# Altium project MCP4725.PrjPcb
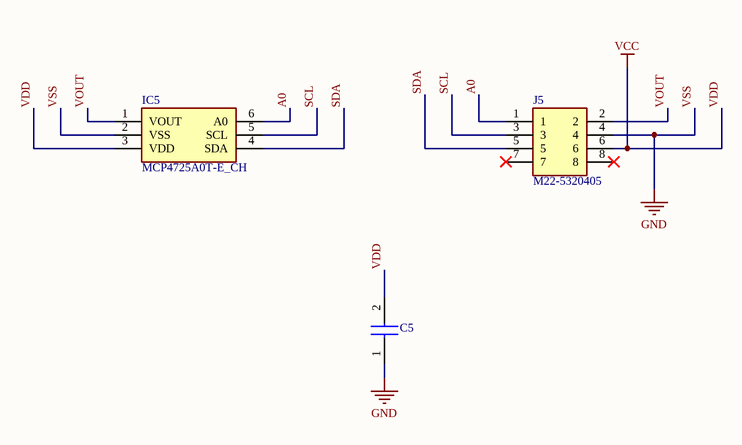
[diagram p0: MCP4725.SchDoc]
1 sheet, 3 parts. Net scope: global (net labels, ports and power ports of the same name join across sheets).
Board file: MCP4725.PcbDoc

## Sheet MCP4725.SchDoc
size A

### Parts
C5  GRM21BR71C105MA01K  [CAPC2012X145N]  (value not drawn)
IC5  MCP4725A0T-E_CH  [SOT95P270X145-6N]
J5  M22-5320405  [HUSSP8W50P200_2X4_800X400X500P]

### Nets
VDD: C5.2 IC5.3(VDD) J5.6  [also labelled VCC]
VSS: C5.1 IC5.2(VSS) J5.4  [also labelled GND]
A0: IC5.6(A0) J5.1
SCL: IC5.5(SCL) J5.3
SDA: IC5.4(SDA) J5.5
VOUT: IC5.1(VOUT) J5.2

Not connected (* = marked no-connect by the designer): J5 7* 8*

### Library data of the parts
C5 = GRM21BR71C105MA01K: Capacitor; Manufacturer_Name: Murata Electronics; Datasheet Link: http://www.murata.com/~/media/webrenewal/support/library/catalog/products/capacitor/mlcc/c02e.pdf; Height: 1.45mm; Manufacturer_Part_Number: GRM21BR71C105MA01K; Mouser Part Number: 81-GRM21R71C105MA01K; Mouser Price/Stock: https://www.mouser.co.uk/ProductDetail/Murata-Electronics/GRM21BR71C105MA01K?qs=%252BOhj5xpo0CKX2ExPHNXi%252Bg%3D%3D
IC5 = MCP4725A0T-E_CH: Integrated Circuit; Manufacturer_Name: Microchip; Manufacturer_Part_Number: MCP4725A0T-E/CH; Datasheet Link: http://ww1.microchip.com/downloads/en/DeviceDoc/22039d.pdf; Height: 1.45mm; Mouser Part Number: 579-MCP4725A0TECH; Mouser Price/Stock: https://www.mouser.co.uk/ProductDetail/Microchip-Technology/MCP4725A0T-E-CH?qs=vkMqrgFpRajeQECZ3goc0A%3D%3D; Arrow Part Number: MCP4725A0T-E/CH; Arrow Price/Stock: https://www.arrow.com/en/products/mcp4725a0t-ech/microchip-technology?region=nac
J5 = M22-5320405: Connector; Manufacturer_Name: Harwin; Datasheet Link: https://cdn.harwin.com/pdfs/M22-532.pdf; Manufacturer_Part_Number: M22-5320405; Mouser Part Number: 855-M22-5320405; Mouser Price/Stock: https://www.mouser.co.uk/ProductDetail/Harwin/M22-5320405?qs=WS5Jv%252B%252Bx1qVxYYIoWES7kw%3D%3D